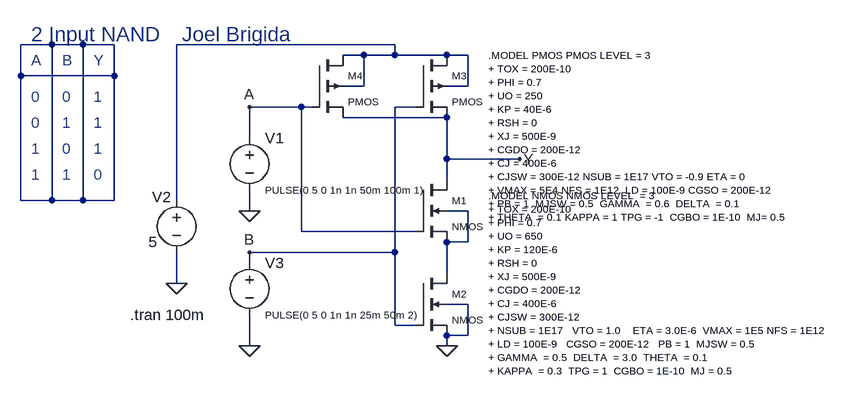
[diagram p0: schematic 2NAND.asc]
2NAND.asc, the LTspice schematic file:
Version 4
SHEET 1 1184 680
WIRE -320 16 -368 16
WIRE -272 16 -320 16
WIRE -224 16 -272 16
WIRE 208 16 -128 16
WIRE 160 32 128 32
WIRE 208 32 208 16
WIRE 208 32 160 32
WIRE 288 32 208 32
WIRE 320 32 288 32
WIRE -368 64 -368 16
WIRE -224 64 -224 16
WIRE -224 64 -368 64
WIRE 160 80 160 32
WIRE 160 80 128 80
WIRE 320 80 320 32
WIRE 320 80 288 80
WIRE 64 112 -16 112
WIRE 80 112 64 112
WIRE 240 112 208 112
WIRE 288 128 128 128
WIRE -16 160 -16 112
WIRE 288 192 288 128
WIRE 400 192 288 192
WIRE 288 224 288 192
WIRE -368 256 -368 64
WIRE -320 256 -320 16
WIRE -320 256 -368 256
WIRE -272 256 -272 16
WIRE -272 256 -320 256
WIRE -224 256 -224 64
WIRE -224 256 -272 256
WIRE -128 256 -128 16
WIRE -16 272 -16 240
WIRE 320 272 288 272
WIRE 64 304 64 112
WIRE 240 304 64 304
WIRE 320 320 320 272
WIRE 320 320 288 320
WIRE 208 336 208 112
WIRE 208 336 -16 336
WIRE -16 352 -16 336
WIRE 288 368 288 320
WIRE -128 384 -128 336
WIRE 320 416 288 416
WIRE 208 448 208 336
WIRE 240 448 208 448
WIRE 320 464 320 416
WIRE 320 464 288 464
WIRE -16 480 -16 432
WIRE 288 480 288 464
FLAG 288 480 0
FLAG 400 192 Y
FLAG -16 272 0
FLAG -16 480 0
FLAG -16 112 A
FLAG -16 336 B
FLAG -128 384 0
SYMBOL nmos4 240 224 R0
WINDOW 0 56 32 Left 1
WINDOW 3 56 72 Left 1
SYMATTR InstName M1
SYMBOL nmos4 240 368 R0
WINDOW 0 56 32 Left 1
WINDOW 3 56 72 Left 1
SYMATTR InstName M2
SYMBOL pmos4 240 32 R0
WINDOW 0 56 32 Left 1
WINDOW 3 56 72 Left 1
SYMATTR InstName M3
SYMBOL pmos4 80 32 R0
WINDOW 0 56 32 Left 1
WINDOW 3 56 72 Left 1
SYMATTR InstName M4
SYMBOL voltage -128 240 R0
WINDOW 0 -38 11 Left 2
WINDOW 3 -43 80 Left 2
WINDOW 123 0 0 Left 0
WINDOW 39 0 0 Left 0
SYMATTR InstName V2
SYMATTR Value 5
SYMBOL voltage -16 336 R0
WINDOW 3 24 96 Left 1
WINDOW 123 0 0 Left 0
WINDOW 39 0 0 Left 0
SYMATTR Value PULSE(0 5 0 1n 1n 25m 50m 2)
SYMATTR InstName V3
SYMBOL voltage -16 144 R0
WINDOW 3 24 96 Left 1
WINDOW 123 0 0 Left 0
WINDOW 39 0 0 Left 0
SYMATTR Value PULSE(0 5 0 1n 1n 50m 100m 1)
SYMATTR InstName V1
TEXT 352 32 Left 1 !.MODEL PMOS PMOS LEVEL = 3\n+ TOX = 200E-10\n+ PHI = 0.7\n+ UO = 250 \n+ KP = 40E-6\n+ RSH = 0\n+ XJ = 500E-9 \n+ CGDO = 200E-12 \n+ CJ = 400E-6\n+ CJSW = 300E-12 NSUB = 1E17 VTO = -0.9 ETA = 0\n+ VMAX = 5E4 NFS = 1E12  LD = 100E-9 CGSO = 200E-12\n+ PB = 1  MJSW = 0.5  GAMMA  = 0.6  DELTA  = 0.1\n+ THETA  = 0.1 KAPPA = 1 TPG = -1  CGBO = 1E-10  MJ= 0.5
TEXT 352 248 Left 1 !.MODEL NMOS NMOS LEVEL  = 3\n+ TOX = 200E-10\n+ PHI = 0.7\n+ UO = 650\n+ KP = 120E-6\n+ RSH = 0\n+ XJ = 500E-9\n+ CGDO = 200E-12\n+ CJ = 400E-6\n+ CJSW = 300E-12\n+ NSUB = 1E17   VTO = 1.0    ETA = 3.0E-6  VMAX = 1E5 NFS = 1E12   \n+ LD = 100E-9   CGSO = 200E-12   PB = 1  MJSW = 0.5\n+ GAMMA  = 0.5  DELTA  = 3.0  THETA  = 0.1\n+ KAPPA  = 0.3  TPG = 1  CGBO = 1E-10  MJ = 0.5
TEXT -120 0 Left 3 ;Joel Brigida
TEXT -200 432 Left 2 !.tran 100m
TEXT -352 40 Left 2 ;A
TEXT -304 40 Left 2 ;B
TEXT -256 40 Left 2 ;Y
TEXT -352 176 Left 2 ;1
TEXT -256 96 Left 2 ;1
TEXT -304 136 Left 2 ;1
TEXT -304 96 Left 2 ;0
TEXT -352 96 Left 2 ;0
TEXT -352 136 Left 2 ;0
TEXT -256 136 Left 2 ;1
TEXT -256 176 Left 2 ;1
TEXT -256 216 Left 2 ;0
TEXT -304 176 Left 2 ;0
TEXT -352 216 Left 2 ;1
TEXT -304 216 Left 2 ;1
TEXT -352 0 Left 3 ;2 Input NAND

The netlist it stands for:
* 2NAND.asc
M1 Y A N003 N003 NMOS
M2 N003 B 0 0 NMOS
M3 N002 B Y N002 PMOS
M4 N002 A Y N002 PMOS
V2 N002 0 5
V3 B 0 PULSE(0 5 0 1n 1n 25m 50m 2)
V1 A 0 PULSE(0 5 0 1n 1n 50m 100m 1)
.model NMOS NMOS
.model PMOS PMOS
.lib standard.mos
.MODEL PMOS PMOS LEVEL = 3
+ TOX = 200E-10
+ PHI = 0.7
+ UO = 250
+ KP = 40E-6
+ RSH = 0
+ XJ = 500E-9
+ CGDO = 200E-12
+ CJ = 400E-6
+ CJSW = 300E-12 NSUB = 1E17 VTO = -0.9 ETA = 0
+ VMAX = 5E4 NFS = 1E12  LD = 100E-9 CGSO = 200E-12
+ PB = 1  MJSW = 0.5  GAMMA  = 0.6  DELTA  = 0.1
+ THETA  = 0.1 KAPPA = 1 TPG = -1  CGBO = 1E-10  MJ= 0.5
.MODEL NMOS NMOS LEVEL  = 3
+ TOX = 200E-10
+ PHI = 0.7
+ UO = 650
+ KP = 120E-6
+ RSH = 0
+ XJ = 500E-9
+ CGDO = 200E-12
+ CJ = 400E-6
+ CJSW = 300E-12
+ NSUB = 1E17   VTO = 1.0    ETA = 3.0E-6  VMAX = 1E5 NFS = 1E12
+ LD = 100E-9   CGSO = 200E-12   PB = 1  MJSW = 0.5
+ GAMMA  = 0.5  DELTA  = 3.0  THETA  = 0.1
+ KAPPA  = 0.3  TPG = 1  CGBO = 1E-10  MJ = 0.5
* Joel Brigida
.tran 100m
* A
* B
* Y
* 1
* 1
* 1
* 0
* 0
* 0
* 1
* 1
* 0
* 0
* 1
* 1
* 2 Input NAND
.backanno
.end